# EAGLE design circuit (EAGLE 6.6.0)
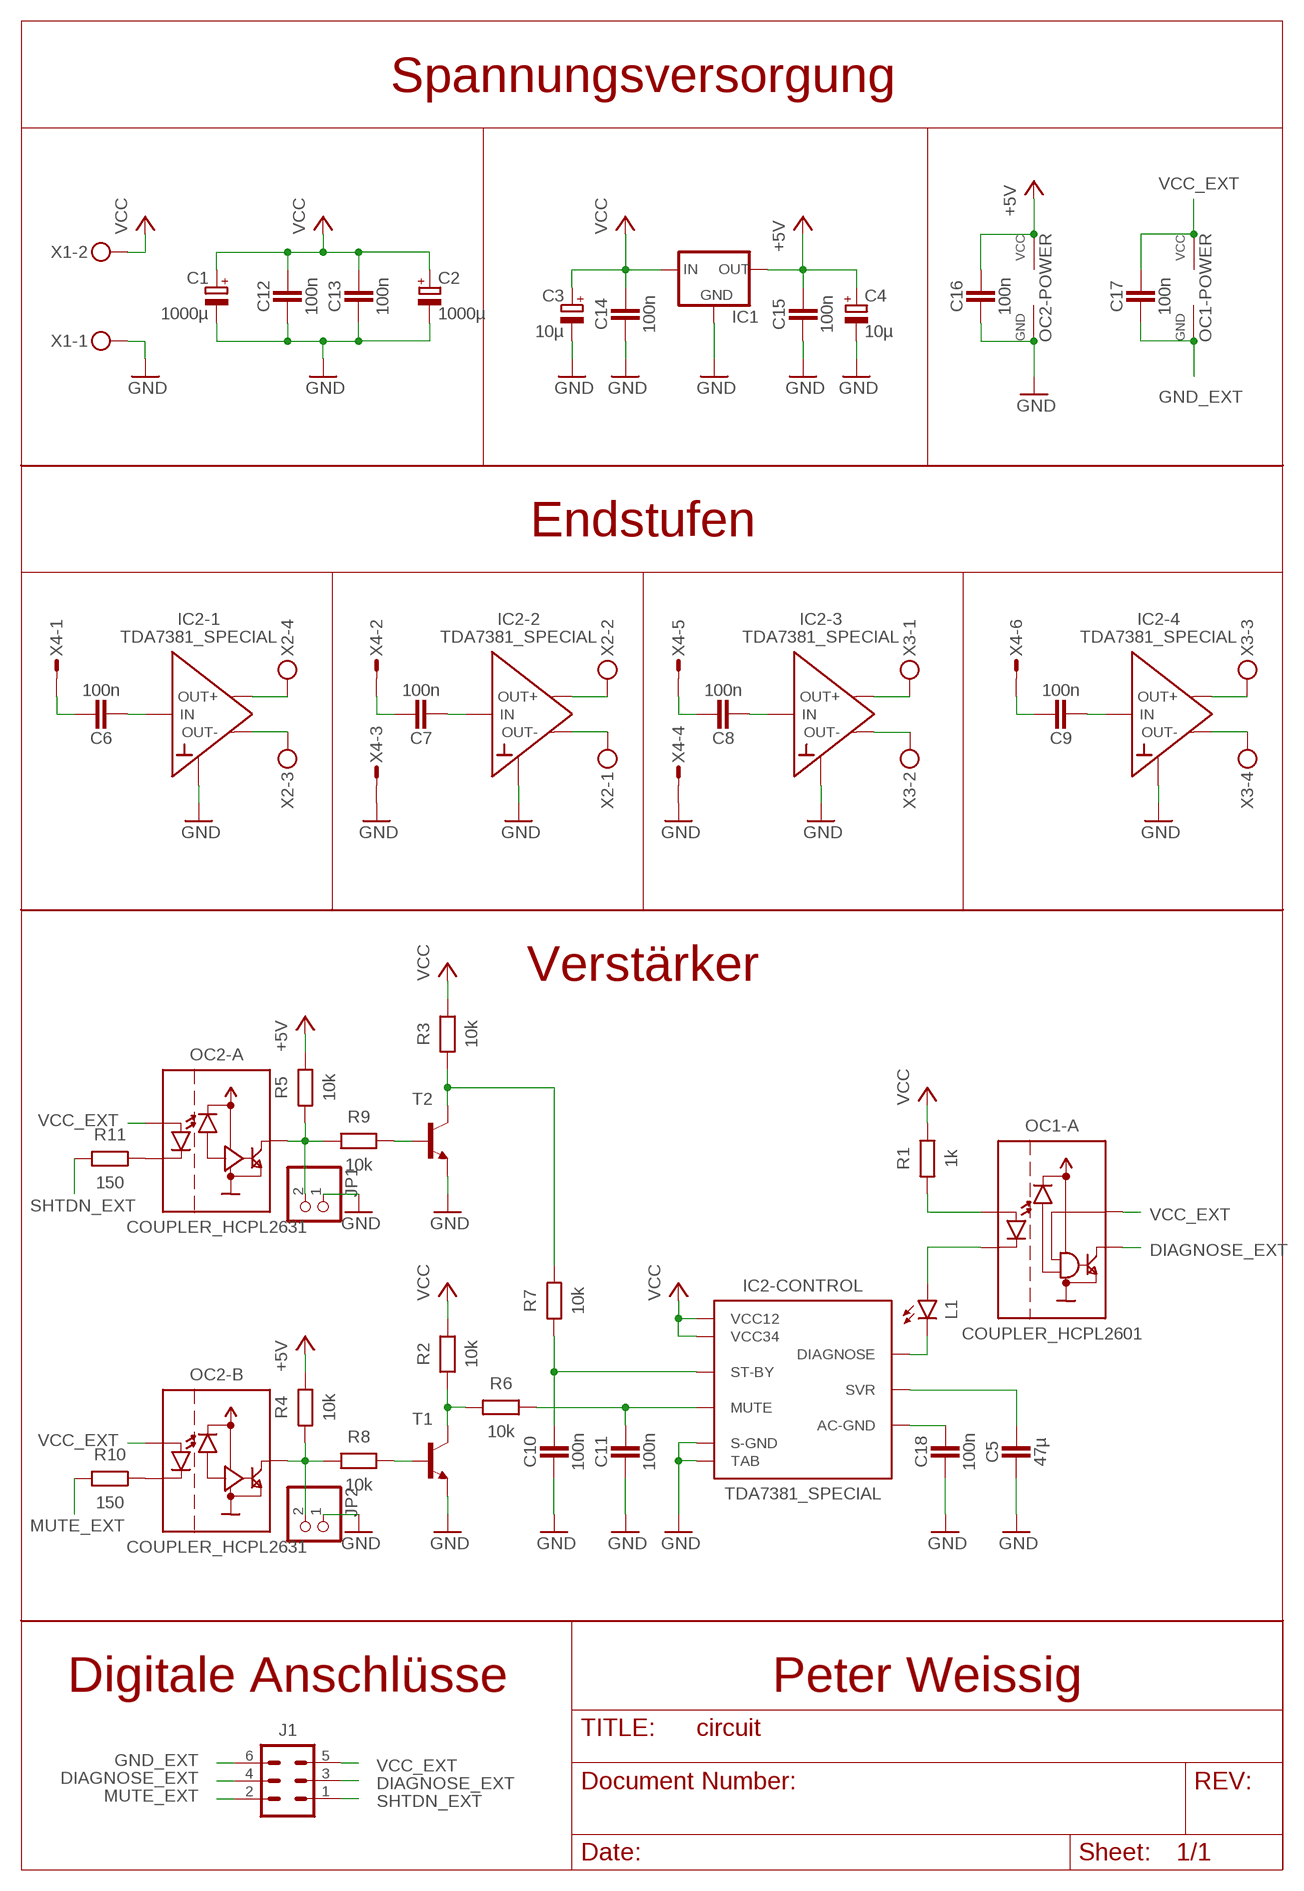
[diagram p0: schematic, sheet 1]

## Parts
C1  1000µ  CPOL-EUE5-10.5  [E5-10,5]
C2  1000µ  CPOL-EUE5-10.5  [E5-10,5]
C3  10µ  CPOL-EUE2-5  [E2-5]
C4  10µ  CPOL-EUE2-5  [E2-5]
C5  47µ  CAPACITATOR-2312S  [SMD_2312S]
C6  100n  CAPACITATOR-5MM  [C_THT_3]
C7  100n  CAPACITATOR-5MM  [C_THT_3]
C8  100n  CAPACITATOR-5MM  [C_THT_3]
C9  100n  CAPACITATOR-5MM  [C_THT_3]
C10  100n  CAPACITATOR-5MM  [C_THT_3]
C11  100n  CAPACITATOR-5MM  [C_THT_3]
C12  100n  CAPACITATOR-1206  [SMD_1206]
C13  100n  CAPACITATOR-1206  [SMD_1206]
C14  100n  CAPACITATOR-1206  [SMD_1206]
C15  100n  CAPACITATOR-1206  [SMD_1206]
C16  100n  CAPACITATOR-1206  [SMD_1206]
C17  100n  CAPACITATOR-1206  [SMD_1206]
C18  100n  CAPACITATOR-1206  [SMD_1206]
IC1  78XXS  [78XXS]
IC2  TDA7381_SPECIAL  [IC_FLEXIWATT25_SPECIAL]
J1  STECKER_WANNE_6  [STECKER_WANNE_6]
JP1  PINHD-1X2  [1X02]
JP2  PINHD-1X2  [1X02]
L1  LED-3MM  [LED_3MM]
OC1  COUPLER_HCPL2601  [IC_DIL08]
OC2  COUPLER_HCPL2631  [IC_DIL08]
R1  1k  RESISTOR-10MM  [R_THT_4]
R2  10k  RESISTOR-10MM  [R_THT_4]
R3  10k  RESISTOR-10MM  [R_THT_4]
R4  10k  RESISTOR-10MM  [R_THT_4]
R5  10k  RESISTOR-10MM  [R_THT_4]
R6  10k  RESISTOR-10MM  [R_THT_4]
R7  10k  RESISTOR-10MM  [R_THT_4]
R8  10k  RESISTOR-1206  [SMD_1206]
R9  10k  RESISTOR-1206  [SMD_1206]
R10  150  RESISTOR-1206  [SMD_1206]
R11  150  RESISTOR-1206  [SMD_1206]
T1  BC548-NPN-TO92-CBE  [TO92-CBE]
T2  BC548-NPN-TO92-CBE  [TO92-CBE]
X1  STECKER_SPG_2  [STECKER_SPG_2]
X2  STECKER_SPG_4  [STECKER_SPG_4]
X3  STECKER_SPG_4  [STECKER_SPG_4]
X4  STECKER_MICROMATCH_6  [STECKER_MICROMATCH_6]

## Nets
+5V: C4.+ C15.1 C16.1 IC1.OUT OC2.8(-POWER:VCC) R4.2 R5.2
DIAGNOSE_EXT: J1.3 J1.4 OC1.6(-A:O)
GND: C1.- C2.- C3.- C4.- C5.2 C10.1 C11.1 C12.2 C13.2 C14.2 C15.2 C16.2 C18.2 IC1.GND IC2.1(-CONTROL:TAB) IC2.2(-2:GND) IC2.8(-1:GND) IC2.13(-CONTROL:S-GND) IC2.18(-3:GND) IC2.24(-4:GND) JP1.1 JP2.1 OC2.5(-POWER:GND) T1.E T2.E X1.1 X4.3 X4.4
GND_EXT: C17.2 J1.6 OC1.5(-POWER:GND)
MUTE_EXT: J1.2 R10.2
N$4: C6.2 IC2.11(-1:IN)
N$5: C6.1 X4.1
N$6: C7.1 X4.2
N$7: C7.2 IC2.12(-2:IN)
N$8: C8.1 X4.5
N$9: C9.1 X4.6
N$10: C8.2 IC2.15(-3:IN)
N$13: C9.2 IC2.14(-4:IN)
N$14: C10.2 IC2.4(-CONTROL:ST-BY) R7.1
N$15: C11.2 IC2.22(-CONTROL:MUTE) R6.1
N$16: C5.1 IC2.10(-CONTROL:SVR)
N$17: C18.1 IC2.16(-CONTROL:AC-GND)
N$18: IC2.25(-CONTROL:DIAGNOSE) L1.K(C)
N$19: L1.A OC1.3(-A:I_K)
N$33: R2.2 R6.2 T1.C
N$34: JP2.2 OC2.6(-B:O) R4.1 R8.1
N$35: R8.2 T1.B
N$36: OC1.2(-A:I_A) R1.1
N$37: R3.2 R7.2 T2.C
N$38: JP1.2 OC2.7(-A:O) R5.1 R9.1
N$39: R9.2 T2.B
N$40: OC2.2(-A:I_K) R11.1
N$41: OC2.3(-B:I_K) R10.1
OUT1+: IC2.9(-1:OUT+) X2.4
OUT1-: IC2.7(-1:OUT-) X2.3
OUT2+: IC2.5(-2:OUT+) X2.2
OUT2-: IC2.3(-2:OUT-) X2.1
OUT3+: IC2.17(-3:OUT+) X3.1
OUT3-: IC2.19(-3:OUT-) X3.2
OUT4+: IC2.21(-4:OUT+) X3.3
OUT4-: IC2.23(-4:OUT-) X3.4
SHTDN_EXT: J1.1 R11.2
VCC: C1.+ C2.+ C3.+ C12.1 C13.1 C14.1 IC1.IN IC2.6(-CONTROL:VCC12) IC2.20(-CONTROL:VCC34) R1.2 R2.1 R3.1 X1.2
VCC_EXT: C17.1 J1.5 OC1.7(-A:I_EN) OC1.8(-POWER:VCC) OC2.1(-A:I_A) OC2.4(-B:I_A)

## Notes on the sheet
- Spannungsversorgung
- Endstufen
- Verstärker
- Digitale Anschlüsse | Peter Weissig

## Library data of the parts
C1-C4 = rcl:CPOL-EU: POLARIZED CAPACITOR, European symbol
C5-C18 = robo_ag:CAPACITATOR: Kondensator
IC1 = v-reg:78XXS: VOLTAGE REGULATOR
IC2 = robo_ag:TDA7381: Audioverstaerker Reichelt:TDA 7381 4x25W 14,4V
J1 = robo_ag:STECKER_WANNE_6: Wannenstecker Reichelt:WSL 6G 2x3 THT
JP1 JP2 = pinhead:PINHD-1X2: PIN HEADER
L1 = robo_ag:LED: Led Reichelt: LA E67B Variante: PLCC4 560-1400mcd 2,2V; 50mA Gelb-Orange SMD Reichelt: LA E67F Variante: PLCC4_REV 560mcd 2,65V; 50mA Orange SMD
OC1 = robo_ag:COUPLER_HCPL2601: Optokoppler Reichelt: HCPL 2601 LED: 1,4V, 30mA Logik: 5V NPN: 7V, 50mA
OC2 = robo_ag:COUPLER_HCPL2631: Optokoppler Reichelt: HCPL 2631 LED: 1,4V, 30mA Logik: 5V NPN: 7V, 50mA
R1-R11 = robo_ag:RESISTOR: Widerstand Reichelt: METALL x,xx[k]
T1 T2 = transistor:*-NPN-: NPN Transistror BF959 corrected 2008.03.06
X1 = robo_ag:STECKER_SPG_2: Anschlussklemme Reichelt:AKL 101-02 Nicht Anreihbar Reichelt:AKL 057-02 Anreihbar
X2 X3 = robo_ag:STECKER_SPG_4: Anschlussklemme Reichelt:RND 205-00014 Nicht Anreihbar
X4 = robo_ag:STECKER_MICROMATCH_6: MicroMatch 6

## Board
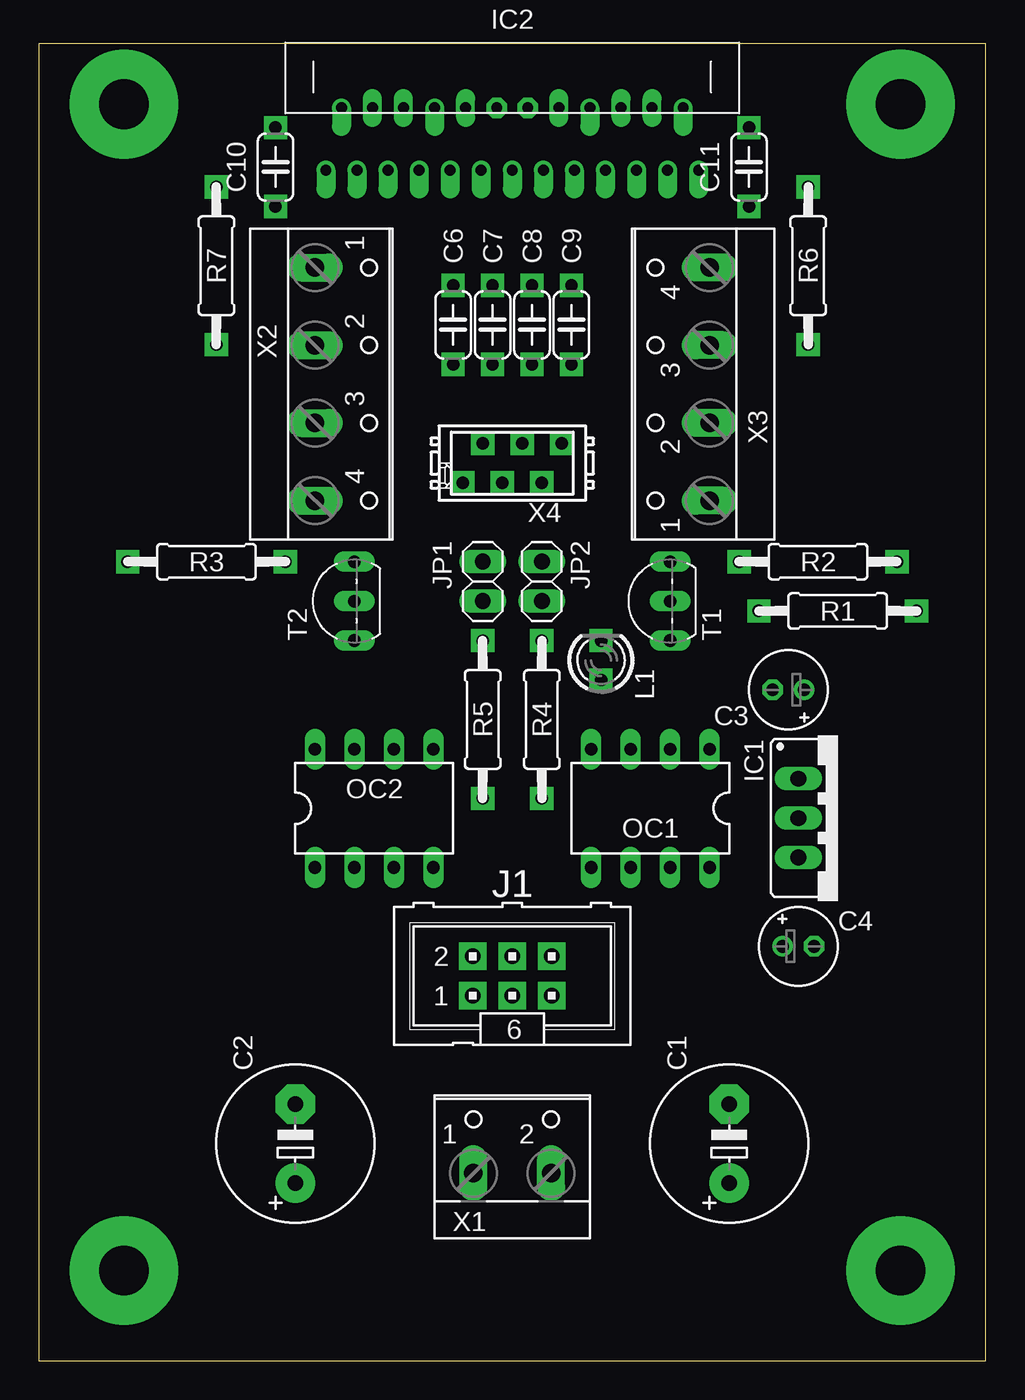
[diagram p1: board, top side]
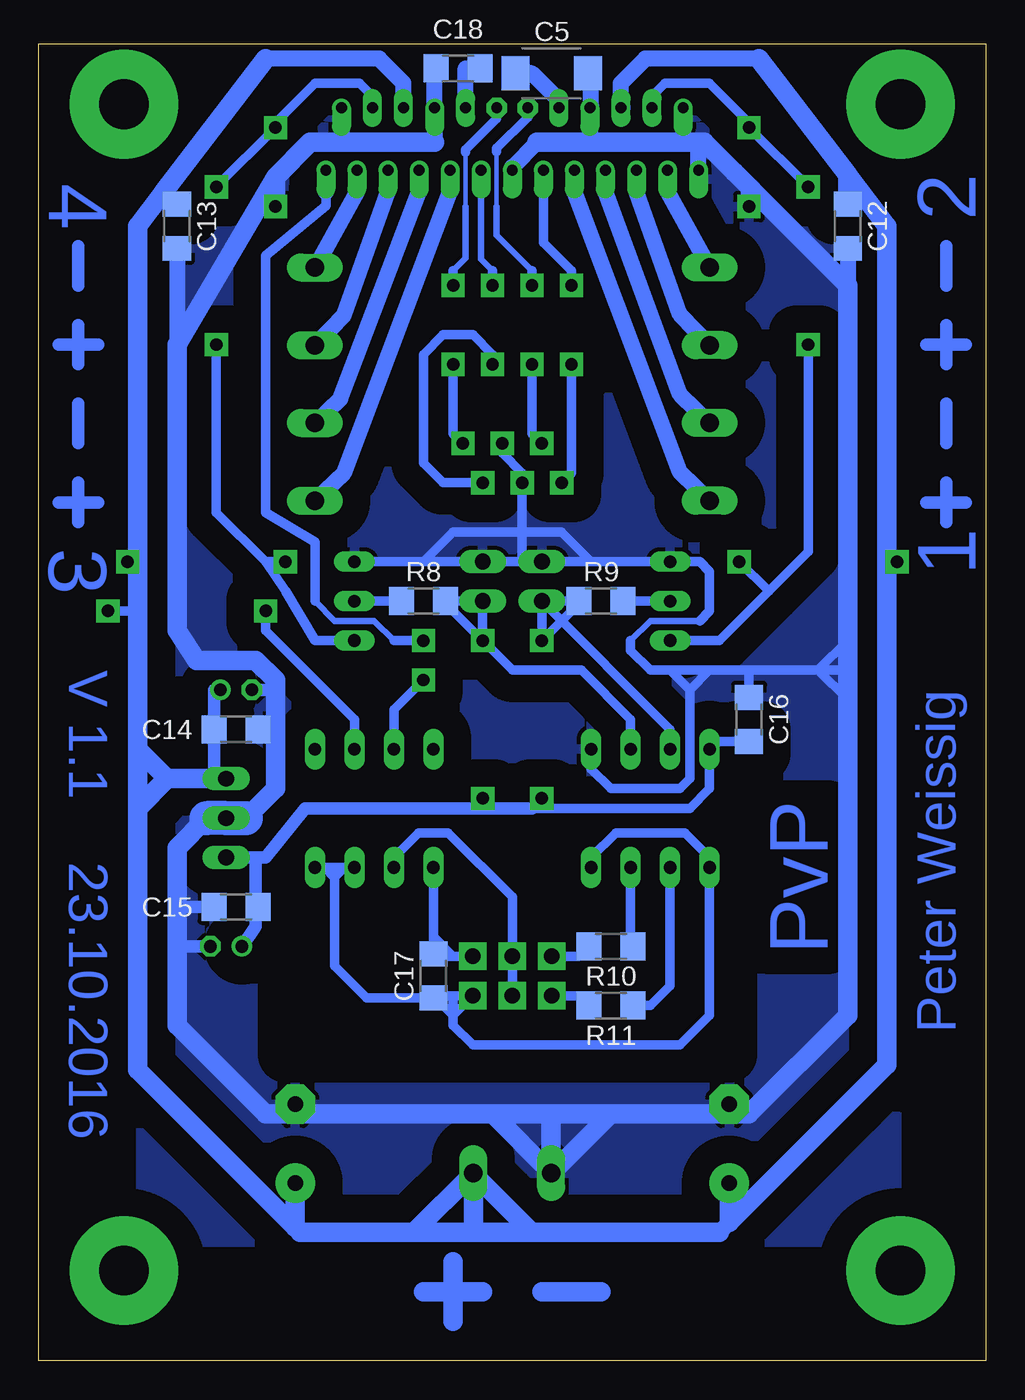
[diagram p2: board, bottom side, seen from below]

Size 60.96 x 84.77 mm. Coordinates in mm from the lower left corner, seen from the top.
Outline: 0,0 60.96,0 60.96,84.77 0,84.77 0,0
Copper layers (1*16): Top 0.035mm / dielectric 1.5mm / Bottom 0.035mm
Design rules "default": minimum track width 10mil, minimum drill 24mil, track to track 8mil, track to pad 8mil, pad to pad 8mil, via to via 8mil, smd to smd 8mil, copper to edge 40mil, drill to drill 8mil, minimum pad ring 10mil, minimum via ring 8mil, stop-mask expansion 4mil, vias tented up to drill 0mil, thermal gap 10mil
bRestrict: area 16.5,19.7 to 45.1,34.3

### Footprints (pad centres in the part's own frame; a part is rotated, then mirrored left to right if it is on the bottom)
E5-10,5 = drill 1.016 pad 2.54: + -2.54,0 | drill 1.016 pad 2.54 octagon: - 2.54,0
E2-5 = drill 0.813 pad 1.27: + -1.016,0 | drill 0.813 pad 1.27 octagon: - 1.016,0
SMD_2312S = smd 1.8 x 2.2: 1 -2.322,0; 2 2.322,0
C_THT_3 = drill 0.8 pad 1.5 square: 1 -2.54,0; 2 2.54,0
SMD_1206 = smd 1.6 x 1.803: 1 -1.422,0; 2 1.422,0
78XXS = drill 1.016 long: GND 0,-2.54; IN -2.54,-2.54; OUT 2.54,-2.54
IC_FLEXIWATT25_SPECIAL = drill 0.7 pad 1.1 offset: 1 -12,-4; 2 -11,0; 3 -10,-4; 5 -8,-4; 7 -6,-4; 8 -5,0; 9 -4,-4; 11 -2,-4; 13 0,-4; 15 2,-4; 17 4,-4; 18 5,0; 19 6,-4; 21 8,-4; 23 10,-4; 24 11,0; 25 12,-4 | drill 0.7 pad 1.1 long: 4 -9,0; 6 -7,0; 10 -3,0; 16 3,0; 20 7,0; 22 9,0 | drill 0.7 pad 1.3 octagon: 12 -1,0; 14 1,0
STECKER_WANNE_6 = drill 1 pad 1.75 square: 1 -2.54,-1.27; 2 -2.54,1.27; 3 0,-1.27; 4 0,1.27; 5 2.54,-1.27; 6 2.54,1.27
1X02 = drill 1.016 long: 1 -1.27,0; 2 1.27,0
LED_3MM = drill 0.8 pad 1.5 square: A -1.27,0; K 1.27,0
IC_DIL08 = drill 0.813 long: 1 -3.81,-3.81; 2 -1.27,-3.81; 3 1.27,-3.81; 4 3.81,-3.81; 5 3.81,3.81; 6 1.27,3.81; 7 -1.27,3.81; 8 -3.81,3.81
R_THT_4 = drill 0.8 pad 1.5 square: 1 -5.08,0; 2 5.08,0
TO92-CBE = drill 0.813 long: B 0,0; C -2.54,0; E 2.54,0
STECKER_SPG_2 = drill 1.194 long: 1 -2.5,-1.27; 2 2.5,-1.27
STECKER_SPG_4 = drill 1.194 long: 1 -7.5,-1.27; 2 -2.5,-1.27; 3 2.5,-1.27; 4 7.5,-1.27
STECKER_MICROMATCH_6 = drill 0.813 pad 1.5 square: 1 3.175,1.27; 2 1.905,-1.27; 3 0.635,1.27; 4 -0.635,-1.27; 5 -1.905,1.27; 6 -3.175,-1.27

### Placement (x,y rotation side)
C1  44.45,13.97 90 top
C2  16.51,13.97 90 top
C3  48.26,43.18 180 top
C4  48.9,26.67 0 top
C5  27.94,82.87 0 bottom
C6  26.67,66.67 90 top
C7  29.21,66.67 90 top
C8  31.75,66.67 90 top
C9  34.29,66.67 90 top
C10  15.24,76.83 90 top
C11  45.72,76.83 90 top
C12  8.89,73.02 270 bottom
C13  52.07,73.02 270 bottom
C14  48.26,40.64 0 bottom
C15  48.26,29.21 180 bottom
C16  15.24,41.27 90 bottom
C17  35.56,24.77 90 bottom
C18  33.97,83.19 180 bottom
IC1  51.44,34.92 270 top
IC2  30.48,80.64 0 top
J1  30.48,24.77 0 top
JP1  28.57,50.16 270 top
JP2  32.39,50.16 270 top
L1  36.2,45.09 90 top
OC1  39.37,35.56 180 top
OC2  21.59,35.56 0 top
R1  51.44,48.26 0 top
R2  50.16,51.43 180 top
R3  10.79,51.43 0 top
R4  32.39,41.27 270 top
R5  28.57,41.27 270 top
R6  49.53,70.48 270 top
R7  11.43,70.48 270 top
R8  36.2,48.89 180 bottom
R9  24.76,48.89 0 bottom
R10  24.13,26.67 180 bottom
R11  24.13,22.86 180 bottom
T1  40.64,48.89 90 top
T2  20.32,48.89 90 top
X1  30.48,13.34 0 top
X2  19.05,62.86 270 top
X3  41.91,62.86 90 top
X4  30.48,57.78 180 top

### Tracks (layer width: path | path; a pad name or v marks a point on that pad's centre or on a via)
+5V
  Bottom 0.61: 27.94,35.56 29.21,35.56 R5.2 27.94,35.56 | 27.94,35.56 19.05,35.56 17.78,36.83 OC2.8 17.3,39.85 C16.1 | 31.75,35.56 R4.2 33.02,35.56
  Bottom 0.813: IC1.OUT 46.99,32.38 | 46.99,32.38 46.99,29.21 | 46.99,29.21 46.99,27.94 C4.+ | C15.1 46.99,29.21 | 46.99,32.38 46.36,32.38 43.82,35.56 33.02,35.56 31.75,35.56 29.21,35.56
DIAGNOSE_EXT
  Bottom 0.61: OC1.6 38.1,32.38 36.51,33.97 34.61,33.97 30.48,29.84 J1.4 J1.3
GND
  Bottom 0.406: 18.41,47.62 21.59,47.62 22.86,46.35
  Bottom 0.61: 25.4,80.72 IC2.8 | 25.4,51.43 JP1.1 29.85,51.43 | 36.2,51.43 JP2.1 29.85,51.43 | 36.2,51.43 T1.E | 25.4,51.43 27.3,53.34 34.29,53.34 36.2,51.43 | 25.4,51.43 T2.E 18.41,51.43 17.78,50.8 17.78,48.26 18.41,47.62 | 22.86,46.35 22.86,45.72 21.59,44.45 20.32,44.45 | 20.32,44.45 17.78,44.45 | 17.78,44.45 15.24,44.45 | 15.24,44.45 10.79,44.45 | 10.79,44.45 8.89,44.45 | OC2.5 25.4,38.1 24.13,36.83 19.68,36.83 19.05,37.46 19.05,43.18 | 19.05,43.18 17.78,44.45 | 19.05,43.18 20.32,44.45 | 10.79,44.45 8.89,42.55 | 10.79,44.45 8.89,46.35 | C16.2 15.24,44.45 | X4.4 31.11,58.42 29.85,57.15 X4.3 29.85,51.43
  Bottom 0.813: C3.- 45.72,43.18 | C4.- 52.07,26.67 | C15.2 52.07,29.21 | C14.2 45.72,40.64
  Bottom 1.016: IC2.24 41.48,78.42 | 35.48,78.42 IC2.18 35.48,83.19 C18.2 | IC2.2 19.48,78.42 | IC2.8 25.48,78.42 | IC2.13 30.48,76.83 28.89,78.42 | 25.4,80.72 25.4,83.19 C5.2 | C10.1 15.24,75.56 16.19,76.52 | C13.2 52.07,65.41 | C12.2 8.89,69.22 | IC2.1 18.48,78.42 19.05,78.42
  Bottom 1.27: 35.48,78.42 41.48,78.42 43.5,78.42 45.72,76.2 | 28.89,78.42 25.48,78.42 19.48,78.42 19.05,78.42 18.1,78.42 16.19,76.52 8.89,69.22 8.89,46.35 8.89,44.45 8.89,42.55 8.89,22.23 15.24,15.88 16.51,15.88 | 45.72,76.2 52.07,65.41 52.07,46.99 50.8,45.09 46.99,45.09 45.72,43.81 45.72,43.18 45.72,40.64 45.72,36.83 47.62,34.92 | C11.1 45.72,76.2 | 16.51,15.88 24.13,15.88 | 24.13,15.88 27.94,15.88 | 27.94,15.88 31.75,15.88 | 31.75,15.88 44.45,15.88 | 44.45,15.88 46.36,15.88 52.07,21.59 52.07,26.67 52.07,29.21 52.07,33.02 50.16,34.92 | X1.1 27.98,15.84 27.94,15.88 | 24.13,15.88 27.94,12.07 31.75,15.88 | C1.- 44.45,15.88 | C2.- 16.51,15.88
  Bottom 2.184: 47.62,34.92 IC1.GND 50.16,34.92
  pour Bottom (isolate 1.778): 5.72,84.45 5.72,7.62 55.25,7.62 55.25,84.45
GND_EXT
  Bottom 0.61: J1.6 34.29,26.03 | 34.29,26.03 35.41,26.03 C17.2 35.56,27.3 | OC1.5 35.56,27.3 | 35.56,27.3 34.29,26.03
MUTE_EXT
  Bottom 0.61: J1.2 26.19,26.03 R10.2
N$1  (via drill 3.2 pad 7)
  other vias: 5.48,5.8
N$2
  Bottom 0.813: 1.27,65.41 3.81,65.41
N$3
  Bottom 0.813: 58.42,71.75 58.42,69.22
N$4
  Bottom 0.61: IC2.11 28.48,71.98 26.67,70.17 C6.2
N$5
  Bottom 0.61: C6.1 26.67,57.15 X4.1
N$6
  Bottom 0.61: C7.1 29.21,59.69 X4.2
N$7
  Bottom 0.305: 31.48,77.83 31.48,74.3
  Bottom 0.406: 31.48,74.3 31.48,72.44 29.21,70.17
  Bottom 0.61: C7.2 29.21,70.17 | IC2.12 29.48,80.06 31.48,78.06 31.48,77.83
N$8
  Bottom 0.61: C8.1 31.75,64.77 33.02,66.04 34.93,66.04 36.2,64.77 36.2,57.78 34.93,56.52 X4.5
N$9
  Bottom 0.61: C9.1 34.29,59.69 X4.6
N$10
  Bottom 0.406: IC2.15 32.48,70.9 31.75,70.17
  Bottom 0.61: C8.2 31.75,70.17
N$11  (via drill 3.2 pad 7)
  other vias: 5.48,80.88
N$12  (via drill 3.2 pad 7)
  other vias: 55.48,5.8
N$13
  Bottom 0.305: 33.48,77.79 33.48,74.3
  Bottom 0.406: 33.48,74.3 33.48,70.98 34.29,70.17
  Bottom 0.61: C9.2 34.29,70.17 | IC2.14 31.48,79.96 33.48,77.96 33.48,77.79
N$14
  Bottom 0.61: IC2.4 21.48,81.39 20.64,82.23 17.78,82.23 15.24,79.69 C10.2 R7.1
N$15
  Bottom 0.61: IC2.22 39.48,81.39 40.32,82.23 43.18,82.23 45.72,79.69 C11.2 R6.1
N$16
  Bottom 1.016: IC2.10 27.48,81.14 29.21,82.87 C5.1
N$17
  Bottom 1.016: IC2.16 33.48,83.19 C18.1
N$18
  Bottom 0.406: 38.1,46.35 39.37,47.62 41.91,47.62 43.18,48.89
  Bottom 0.61: 42.48,75.25 42.48,74.36 46.36,71.12 46.36,54.61 43.18,52.7 43.18,48.89 | 38.1,46.35 L1.K
  Bottom 1.016: IC2.25 42.48,75.25
N$19
  Bottom 0.61: OC1.3 38.1,41.91 L1.A
N$20
  Bottom 0.813: 1.27,55.24 3.81,55.24
N$21
  Bottom 0.813: 2.54,56.52 2.54,53.98
N$22
  Bottom 0.813: 57.15,65.41 59.69,65.41
N$23
  Bottom 0.813: 58.42,66.67 58.42,64.14
N$24
  Bottom 0.813: 57.15,55.24 59.69,55.24
N$25
  Bottom 0.813: 58.42,56.52 58.42,53.98
N$26
  Bottom 1.27: 24.76,4.45 28.57,4.45
N$27
  Bottom 1.27: 32.39,4.45 36.2,4.45
N$28
  Bottom 1.27: 34.29,6.35 34.29,2.54
N$29
  Bottom 0.813: 2.54,66.67 2.54,64.14
N$30
  Bottom 0.813: 2.54,71.75 2.54,69.22
N$31
  Bottom 0.813: 2.54,61.59 2.54,59.05
N$32
  Bottom 0.813: 58.42,61.59 58.42,59.05
N$33
  Bottom 0.61: R6.2 49.53,54.61 46.36,51.43 | T1.C 43.18,46.35 45.09,49.53 46.36,51.43 | R2.2 46.36,51.43
N$34
  Bottom 0.61: R4.1 JP2.2 R8.1 34.93,48.89 30.48,44.45 26.04,44.45 22.86,41.27 OC2.6
N$35
  Bottom 0.61: R8.2 T1.B
N$36
  Bottom 0.61: OC1.2 40.64,41.27 46.36,46.99 R1.1
N$37
  Bottom 0.61: R7.2 11.43,52.07 13.97,49.53 | R3.2 13.97,49.53 | T2.C 17.14,46.35 13.97,49.53
N$38
  Bottom 0.61: JP1.2 R5.1 26.04,48.89 | R9.1 JP1.2 | OC2.7 20.32,40.64 JP1.2
N$39
  Bottom 0.61: R9.2 T2.B
N$40
  Bottom 0.61: OC2.2 20.32,24.13 21.59,22.86 R11.1
N$41
  Bottom 0.61: R10.1 22.86,26.82 OC2.3
N$1001  (via drill 3.2 pad 7)
  other vias: 55.48,80.88
OUT1+
  Bottom 1.016: IC2.9 26.48,75.25 19.68,57.19 X2.4
OUT1-
  Bottom 1.016: IC2.7 24.48,75.25 19.68,62.19 X2.3
OUT2+
  Bottom 1.016: IC2.5 22.48,75.25 19.68,67.35 X2.2
OUT2-
  Bottom 1.016: IC2.3 20.48,75.25 X2.1
OUT3+
  Bottom 1.016: IC2.17 34.48,75.25 41.32,57.15 X3.1
OUT3-
  Bottom 1.016: IC2.19 36.48,75.25 41.55,61.91 X3.2
OUT4+
  Bottom 1.016: IC2.21 38.48,75.25 41.32,67.31 X3.3
OUT4-
  Bottom 1.016: IC2.23 40.48,75.25 X3.4
SHTDN_EXT
  Bottom 0.61: J1.1 26.19,23.49 R11.2
VCC
  Bottom 0.61: R3.1 6.35,51.43 | R2.1 54.61,50.8 | R1.2 54.61,48.26
  Bottom 0.813: 49.53,37.46 49.68,37.46 C14.1 49.68,43.18 C3.+
  Bottom 1.016: 23.49,80.64 23.49,82.23 21.91,83.82 14.61,83.82 | IC2.20 37.48,82.25 39.05,83.82 46.36,83.82 | 16.51,8.89 17.14,8.25 | 8.89,76.18 8.82,76.25 | C13.1 52.29,74.45 | 44.45,8.57 44.13,8.25
  Bottom 1.27: IC2.6 23.49,80.64 | 46.36,83.82 52.99,75.15 | 52.99,75.15 54.61,73.02 54.61,50.8 54.61,48.26 54.61,39.37 | 54.61,39.37 54.61,35.56 | 54.61,35.56 54.61,18.73 44.45,8.57 C1.+ | 14.61,83.82 8.82,76.25 6.35,73.02 6.35,51.43 6.35,19.05 16.51,8.89 C2.+ | 17.14,8.25 29.21,8.25 | 29.21,8.25 33.02,8.25 | 33.02,8.25 36.83,8.25 | 36.83,8.25 44.13,8.25 | X1.2 32.98,8.29 33.02,8.25 | 29.21,8.25 33.02,12.07 36.83,8.25 | C12.1 8.89,76.18 | 52.29,74.45 52.99,75.15 | IC1.IN 49.53,37.46 52.71,37.46 | 52.71,37.46 54.61,35.56 | 52.71,37.46 54.61,39.37
VCC_EXT
  Bottom 0.61: 34.29,23.49 J1.5 34.29,22.23 | 34.29,23.49 35.41,23.49 C17.1 39.85,23.34 41.91,25.4 41.91,31.12 | OC1.7 41.28,31.75 | 41.28,31.75 41.91,31.75 | 41.91,31.75 42.55,31.75 | 42.55,31.75 OC1.8 | 41.91,31.12 41.91,31.75 | 41.91,31.12 42.55,31.75 | 41.28,31.75 41.91,31.12 | OC2.4 25.4,32.38 23.81,33.97 19.37,33.97 17.78,32.38 OC2.1 17.78,22.23 19.68,20.32 33.02,20.32 34.29,21.59 34.29,22.23 | 34.29,22.23 34.29,23.49 | 34.29,22.23 35.56,23.49

### Text on the board
Bottom: 2 | 4 | 1 | 3 | V 1.1 23.10.2016 | Peter Weissig | PvP